# Altium schematic sheet I2c.SchDoc
size A; SheetNumber: 1; SheetTotal: 1
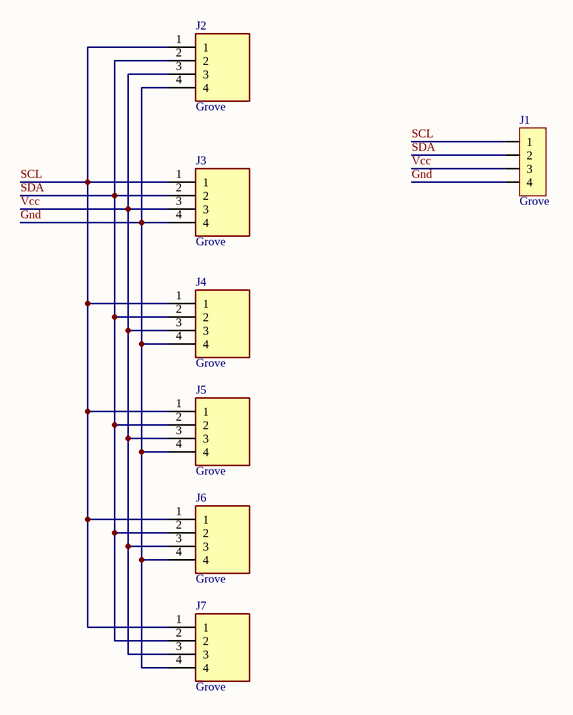
[diagram p0: I2c.SchDoc]

## Parts
J1  Grove  [HDR/Header/4/2mm/BOX/SMD]
J2  Grove  [SEEED_110990030]
J3  Grove  [SEEED_110990030]
J4  Grove  [SEEED_110990030]
J5  Grove  [SEEED_110990030]
J6  Grove  [SEEED_110990030]
J7  Grove  [SEEED_110990030]

## Nets
Gnd: J1.4 J2.4 J3.4 J4.4 J5.4 J6.4 J7.4
SCL: J1.1 J2.1 J3.1 J4.1 J5.1 J6.1 J7.1
SDA: J1.2 J2.2 J3.2 J4.2 J5.2 J6.2 J7.2
Vcc: J1.3 J2.3 J3.3 J4.3 J5.3 J6.3 J7.3

## Library data of the parts
J1 = Header 4: Header, 4-Pin
J2-J7 = 110990030: GROVE 2MM 4PIN VERT CONN 10PCS; MF: Seeed Technology; Arrow_Electronics-Purchase-URL: https://snapeda.com/shop?store=Arrow+Electronics&id=583576; Availability: Good; Package: None; Price: None; Mouser-Purchase-URL: https://snapeda.com/shop?store=Mouser&id=583576; MP: 110990030; SnapEDA_Link: https://www.snapeda.com/parts/110990030/Seeed%20Technology%20Co.,%20Ltd/view-part/583576/?ref=snap; Value: *